# EAGLE design SparkFun_Infrared_Proximity_Breakout-VCNL4000 (EAGLE 7.2.0)
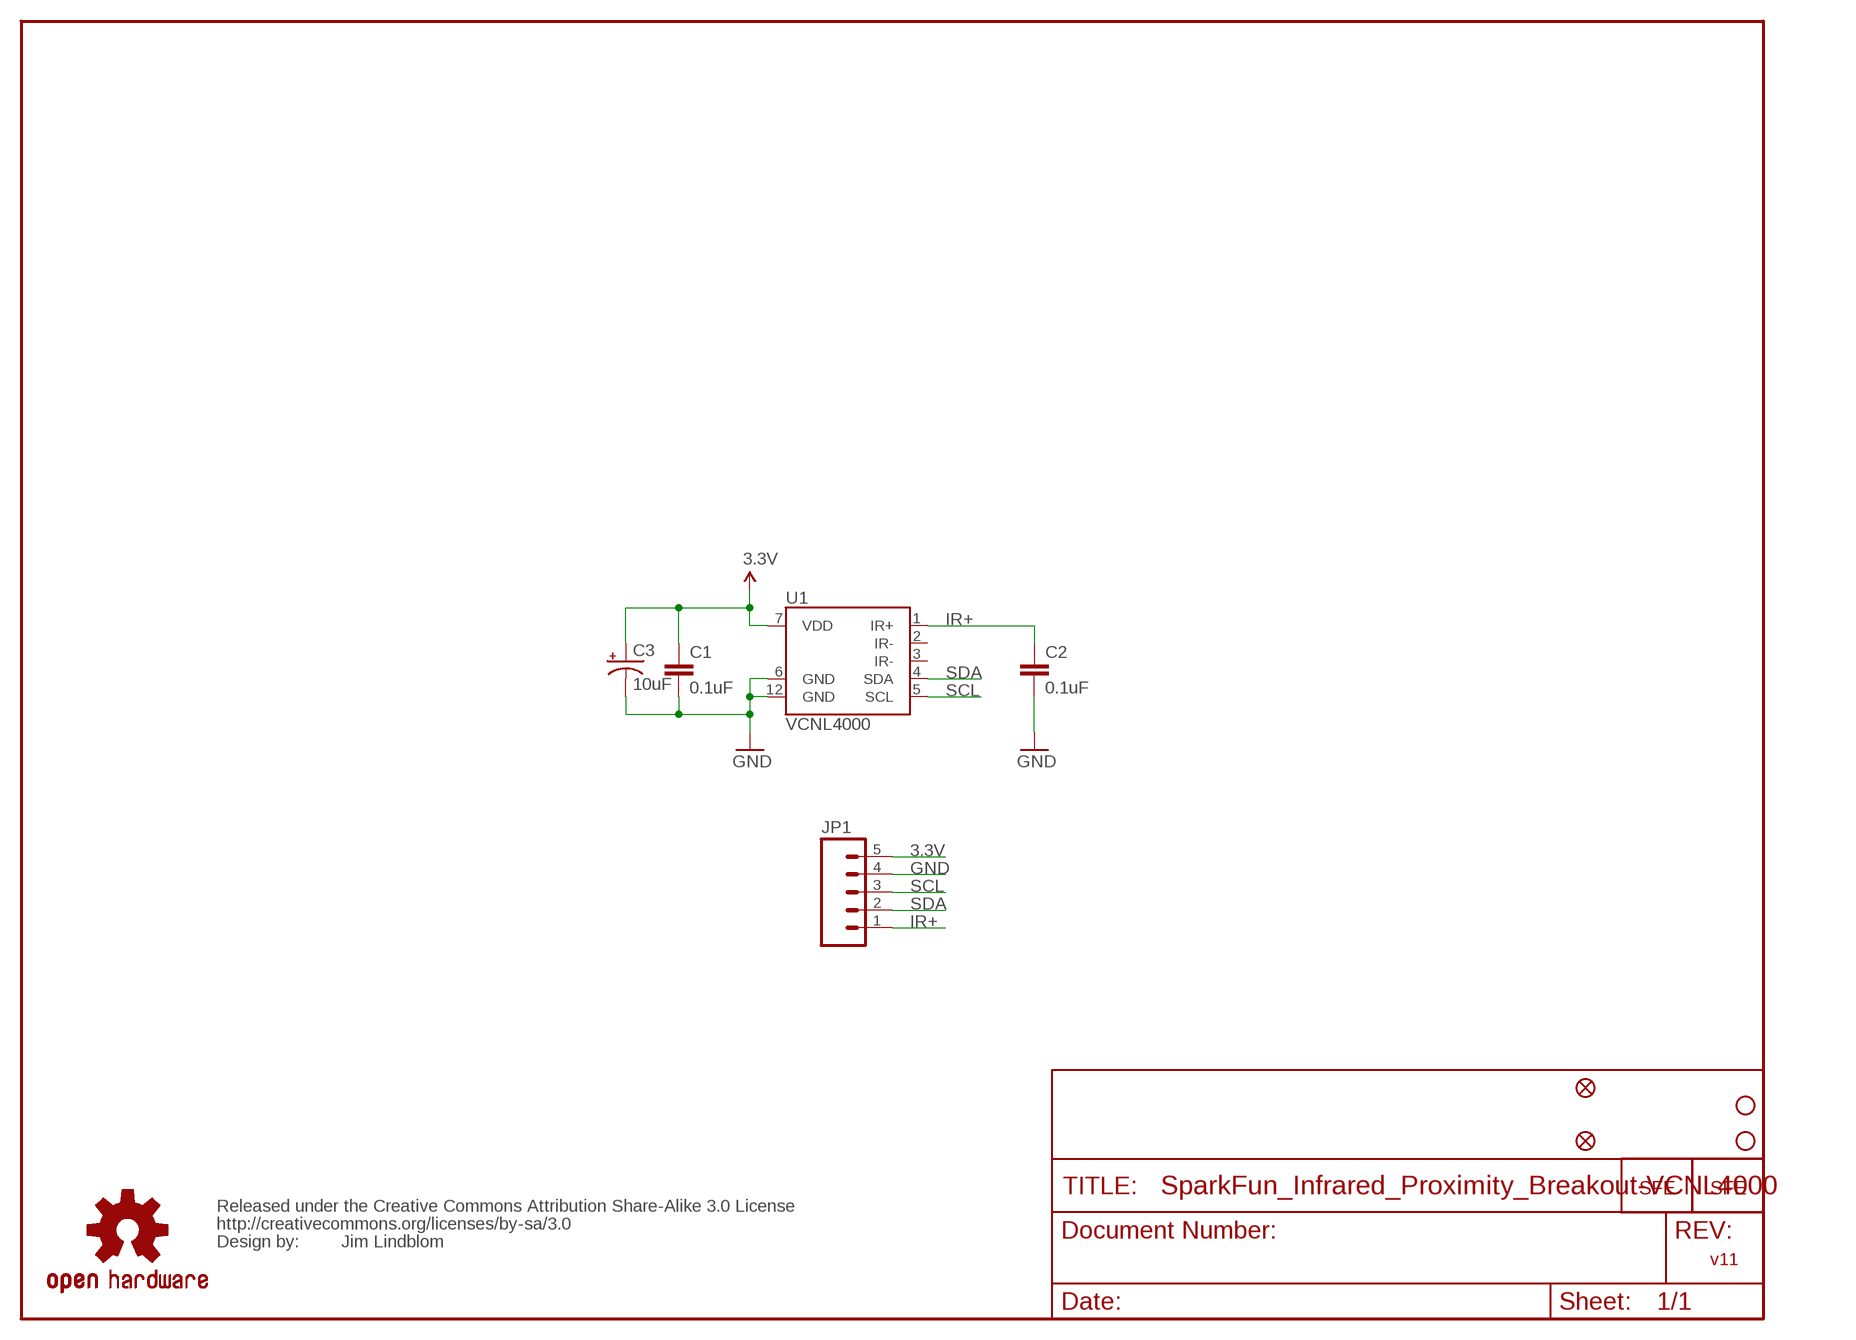
[diagram p0: schematic, sheet 1]

## Parts
C1  0.1uF  CAP0402-CAP  [0402-CAP]
C2  0.1uF  CAP0402-CAP  [0402-CAP]
C3  10uF  CAP_POL1206  [EIA3216]
JP1  M05PTH  [1X05]
JP2  LOGO-SFENW2  [SFE-NEW-WEB]
JP3  STAND-OFF  [STAND-OFF]
JP4  STAND-OFF  [STAND-OFF]
JP5  LOGO-SFESK  [SFE-LOGO-FLAME]
JP6  FIDUCIALUFIDUCIAL  [MICRO-FIDUCIAL]
JP7  FIDUCIALUFIDUCIAL  [MICRO-FIDUCIAL]
U1  VCNL4000  [VCNL4000]
U$1  OSHW-LOGOS  [OSHW-LOGO-S]
U$2  CREATIVE_COMMONS  [CREATIVE_COMMONS]

## Nets
3.3V: C1.1 C3.A(+) JP1.5 U1.7(VDD)
GND: C1.2 C2.2 C3.C(-) JP1.4 U1.6(GND) U1.12(GND)
IR+: C2.1 JP1.1 U1.1(IR+)
SCL: JP1.3 U1.5(SCL)
SDA: JP1.2 U1.4(SDA)
Unconnected: U1.2(IR-) U1.3(IR-)

## Notes on the sheet
- Jim Lindblom
- v11

## Library data of the parts
C1 C2 = SparkFun:CAP: Capacitor Standard 0603 ceramic capacitor, and 0.1" leaded capacitor.
C3 = SparkFun:CAP_POL: Capacitor Polarized These are standard SMD and PTH capacitors. Normally 10uF, 47uF, and 100uF in electrolytic and tantalum varieties. Always verify the external diameter of the through hole cap, it varies with capacity, voltage, and manufacturer. The EIA devices should be standard.
JP1 = SparkFun:M05: Header 5 Standard 5-pin 0.1" header. Use with straight break away headers (SKU : PRT-00116), right angle break away headers (PRT-00553), swiss pins (PRT-00743), machine pins (PRT-00117), and female headers (PRT-00115). Molex polarized connector foot print use with SKU : PRT-08230 with associated crimp pins and housings.
JP2 JP5 = SparkFun:LOGO-SFE: Spark Fun Electronics PCB Logo This is the standard Spark Fun Electronics PCB logo.
JP3 JP4 = SparkFun:STAND-OFF: Stand Off This is the mechanical footprint for a #4 phillips button head screw. Use the keepout ring to avoid running the screw head into surrounding components. SKU : PRT-00447
JP6 JP7 = SparkFun:FIDUCIAL: Fiducial Alignment Points Various fiducial points for machine vision alignment.
U1 = SparkFun:VCNL4000: VNCL4000 Fully integrated proximity and ambient light sensor with infrared emitter and I2C interface
U$1 = SparkFun:OSHW-LOGO: Open Source Hardware Logo This logo indicates the piece of hardware it is found on incorporates a OSHW license and/or adheres to the definition of open source hardware found here: http://freedomdefined.org/OSHW
U$2 = SparkFun:CREATIVE_COMMONS

## Board
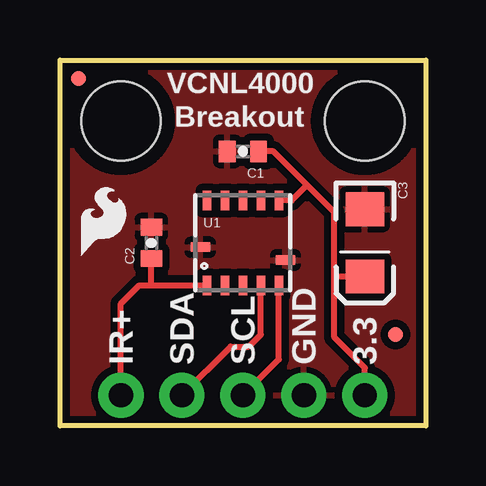
[diagram p1: board, top side]
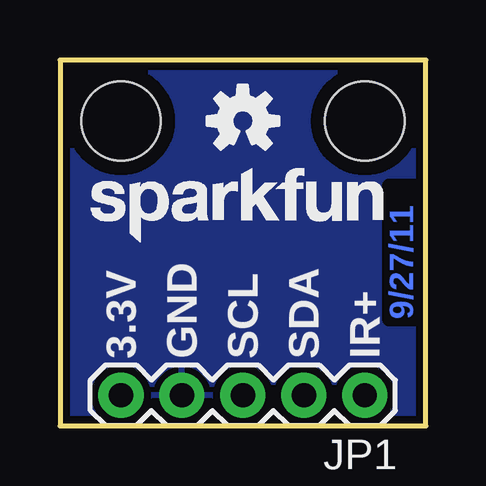
[diagram p2: board, bottom side, seen from below]

Size 15.24 x 15.24 mm. Coordinates in mm from the lower left corner, seen from the top.
Outline: 0,0 0,15.24 15.24,15.24 15.24,0 0,0
Copper layers (1*16): Top 0.035mm / dielectric 1.5mm / Bottom 0.035mm
Design rules "SparkFun": minimum track width 8mil, minimum drill 20mil, track to track 8mil, track to pad 8mil, pad to pad 8mil, via to via 8mil, smd to smd 8mil, copper to edge 8mil, drill to drill 8mil, minimum pad ring 12mil, minimum via ring 10mil, stop-mask expansion 4mil, vias tented up to drill 20mil, thermal gap 10mil

### Footprints (pad centres in the part's own frame; a part is rotated, then mirrored left to right if it is on the bottom)
0402-CAP = smd 0.7 x 0.9: 1 -0.65,0; 2 0.65,0
EIA3216 = smd 1.4 x 1.6: A 1.4,0; C -1.4,0
1X05 = drill 1.016 pad 1.88: 1 0,0; 2 2.54,0; 3 5.08,0; 4 7.62,0; 5 10.16,0
STAND-OFF = hole 3.302: 0,0
MICRO-FIDUCIAL = smd 0.635 x 0.635: 1 0,0
VCNL4000 = smd 0.35 x 0.805: 1 -1.5,-1.772; 2 -0.75,-1.772; 3 0,-1.772; 4 0.75,-1.772; 5 1.5,-1.772; 7 1.5,1.772; 8 0.75,1.772; 9 0,1.772; 10 -0.75,1.772; 11 -1.5,1.772 | smd 0.805 x 0.4: 6 1.772,-0.715; 12 -1.772,-0.175

### Placement (x,y rotation side)
C1  7.62,11.43 180 top
C2  3.81,7.62 90 top
C3  12.7,7.62 270 top
JP1  2.54,1.27 180 bottom
JP2  13.97,7.62 0 bottom
JP3  2.54,12.7 0 top
JP4  12.7,12.7 0 top
JP5  0.89,7.11 0 top
JP6  13.97,3.81 0 top
JP7  0.76,14.48 0 top
U1  7.62,7.62 0 top
U$1  7.62,12.7 0 bottom
U$2  -8.89,-3.81 0 top  (outside the outline)

### Tracks (layer width: path | path; a pad name or v marks a point on that pad's centre or on a via)
3.3V
  Top 0.254: JP1.5 12.7,2.41 11.43,3.68 11.43,6.22 | C1.1 8.89,11.43 10.35,9.97 | U1.7 9.66,9.39 10.23,9.97 10.35,9.97 | C3.A 11.43,6.22 | 10.35,9.97 11.43,8.89 11.43,6.22
GND
  pour Bottom (isolate 0.305): 0,0 0,15.24 15.24,15.24 15.24,0
  pour Top (isolate 0.305): 0,0 0,15.24 15.24,15.24 15.24,0
IR+
  Top 0.254: 3.81,5.85 3.31,5.85 2.54,5.08 JP1.1 | 3.81,5.85 U1.1 | 3.81,5.85 C2.1
SCL
  Top 0.254: U1.5 9.12,2.77 JP1.3
SDA
  Top 0.254: U1.4 8.37,3.8 7.87,3.3 7.11,3.3 JP1.2

### Text on the board
Bottom: 9/27/11
tPlace: VCNL4000 | Breakout | IR+ | SDA | SCL | GND | 3.3
bPlace: IR+ | SDA | SCL | GND | 3.3V